# Altium project Monitor_Board_Model_temporary_H202.PrjPcb (part 2 of 3)

## Sheet Membrane_Keypad.SchDoc: Membrane Keypad Interface
size A4; DocumentNumber: 13; SheetNumber: 13; SheetTotal: 31
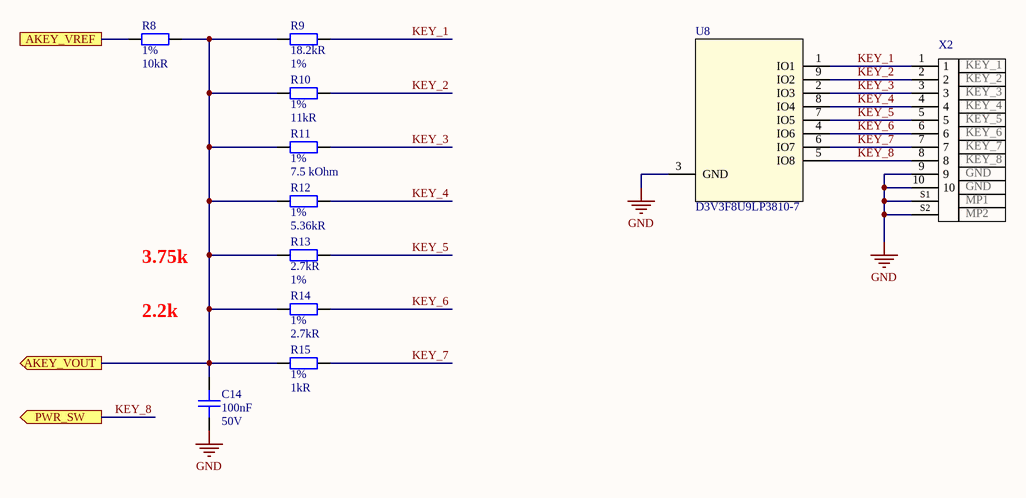
[diagram p5: Membrane_Keypad.SchDoc]

### Parts
C14  Capacitance: 100nF  Voltage: 50V  [C0402]  (hidden comment: CAP CER 0.1UF 50V X7R 0402)
R8  Tolerance: 1%  Resistance: 10kR  [0402R]  (hidden comment: RES SMD 10K OHM 1% 1/16W 0402)
R9  Resistance: 18.2kR  Tolerance: 1%  [R_0402]  (hidden comment: RES SMD 18.2K OHM 1% 1/16W 0402)
R10  Tolerance: 1%  Resistance: 11kR  [R_0402]  (hidden comment: RES SMD 11K OHM 1% 1/16W 0402)
R11  Tolerance: 1%  Resistance: 7.5 kOhm  [R_0402]  (hidden comment: RES SMD 7.5K OHM 1% 1/10W 0603)
R12  Tolerance: 1%  Resistance: 5.36kR  [R_0402]  (hidden comment: RES SMD 5.36K OHM 1% 1/16W 0402)
R13  Resistance: 2.7kR  Tolerance: 1%  [R_0402]  (hidden comment: RC0402FR-072K7L)
R14  Tolerance: 1%  Resistance: 2.7kR  [R_0402]  (hidden comment: RES SMD 2.7K OHM 1% 1/16W 0402)
R15  Tolerance: 1%  Resistance: 1kR  [R_0402]  (hidden comment: RES SMD 1K OHM 1% 1/16W 0402)
U8  D3V3F8U9LP3810-7  [U-DFN3810-9]
X2  pin_7: KEY_7  pin_1: KEY_1  pin_2: KEY_2  pin_3: KEY_3  pin_4: KEY_4  pin_5: KEY_5  pin_6: KEY_6  pin_8: KEY_8  pin_MP2: MP2  pin_MP1: MP1  pin_9: GND  [MOLEX_5034801000]  (hidden comment: CONN 5034801000 FFC FPC 10POS 0.50MM R/A)

### Ports
AKEY_VOUT (out), AKEY_VREF, PWR_SW (out)

### Nets
GND: C14.1 U8.3(GND) X2.9 X2.10 X2.S1(MP1) X2.S2(MP2)
1V8_VDD: R8.2 ; port AKEY_VREF
ADCIN: C14.2 R8.1 R9.1 R10.1 R11.1 R12.1 R13.1 R14.1 R15.1 ; port AKEY_VOUT
KEY_1: R9.2 U8.1(IO1) X2.1
KEY_2: R10.2 U8.9(IO2) X2.2
KEY_3: R11.2 U8.2(IO3) X2.3
KEY_4: R12.2 U8.8(IO4) X2.4
KEY_5: R13.2 U8.7(IO5) X2.5
KEY_6: R14.2 U8.4(IO6) X2.6
KEY_7: R15.2 U8.6(IO7) X2.7
KEY_8: U8.5(IO8) X2.8 ; port PWR_SW  [project net ~{MR}]

### Notes on the sheet
- 3.75k
- 2.2k
- Title
- Size:
- Date:
- A4
- Number:
- Time:
- Revision:
- Sheet
- of
- File:

### Library data of the parts
C14 = CAP CER 0.1UF 50V X7R 0402: 0.1µF ±10% 50V Ceramic Capacitor X7R 0402 (1005 Metric); Manufacturer: TDK; Manufacturer Part Number: CGA2B3X7R1H104K050BB; Supplier 1: Digi-Key; Stock 1: 2925303; Pricing 1: 1=0.17, 10=0.118, 50=0.0668, 100=0.0553, 500=0.0388, 1000=0.0321, 2500=0.0299, 5000=0.0273 (USD); Mount: Surface Mount; Case/Package: 0402; Weight: 2.3E-05oz; Case Code (Metric): 1005; Case Code (Imperial): 0402; Min Operating Temperature: -55°C; Max Operating Temperature: 125°C; Voltage Rating: 50V; Tolerance: 10%; Packaging: Tape and Reel; Package Quantity: 1; Voltage Rating (DC): 50V; Dielectric: X7R; Termination: SMD/SMT; Composition: Ceramic; Length: 1mm; Height: 0.5mm; Width: 0.02inch; Thickness: 0.022inch; Depth: 0.5mm; Ratings: AEC-Q200; REACH SVHC: No SVHC; Lead Free: Lead Free; ComponentLink1URL: http://product.tdk.com/capacitor/mlcc/en/documents/mlccspec_automotive_general_midvoltage_en.pdf?src-supplier=Future+Electronics; ComponentLink1Description: http://product.tdk.com/capacitor/mlcc/en/documents/mlccspec_automotive_general_midvoltage_en.pdf?src-supplier=Future+Electronics; ComponentLink2URL: http://www.farnell.com/datasheets/1807242.pdf?src-supplier=Element14; ComponentLink2Description: http://www.farnell.com/datasheets/1807242.pdf?src-supplier=Element14; ComponentLink3URL: http://www.mouser.com/ds/2/400/lcc_automotive_general_en-843974.pdf?src-supplier=Mouser; ComponentLink3Description: http://www.mouser.com/ds/2/400/lcc_automotive_general_en-843974.pdf?src-supplier=Mouser; ComponentLink4URL: http://www.farnell.com/datasheets/1936565.pdf?src-supplier=Element14; ComponentLink4Description: http://www.farnell.com/datasheets/1936565.pdf?src-supplier=Element14; ComponentLink5URL: http://www.farnell.com/datasheets/1735392.pdf?src-supplier=Element14; ComponentLink5Description: http://www.farnell.com/datasheets/1735392.pdf?src-supplier=Element14; Supplier Part Number 1: 445-6899-1-ND
R8 = RES SMD 10K OHM 1% 1/16W 0402: 10 kOhms ±1% 0.063W, 1/16W Chip Resistor 0402 (1005 Metric) Moisture Resistant Thick Film; Manufacturer: Yageo; Manufacturer Part Number: RC0402FR-0710KP; Temperature Coefficient: 150ppm/°C; Max Power Dissipation: 63mW; Supplier 1: Digi-Key; Stock 1: 839368; Pricing 1: 1=0.1, 10=0.035, 100=0.014, 1000=0.0063, 2500=0.0055, 5000=0.0045 (USD); Case Code (Metric): 1005; Case Code (Imperial): 0402; Min Operating Temperature: -55°C; Max Operating Temperature: 155°C; Packaging: Tape and Reel; Composition: Thick Film; Number of Terminations: 2; Features: Moisture Resistant; Length: 0.039inch; Height: 0.016inch; Width: 0.02inch; ComponentLink1URL: http://www.yageo.com/NewPortal/yageodocoutput?fileName=/pdf/R-Chip/PYu-RC_51_RoHS_P_0.pdf&src-supplier=Digi-Key; ComponentLink1Description: http://www.yageo.com/NewPortal/yageodocoutput?fileName=/pdf/R-Chip/PYu-RC_51_RoHS_P_0.pdf&src-supplier=Digi-Key; Supplier Part Number 1: YAG1249CT-ND; Case/Package: 0402
R9 = RES SMD 18.2K OHM 1% 1/16W 0402: 18.2 kOhms ±1% 0.063W, 1/16W Chip Resistor 0402 (1005 Metric) Moisture Resistant Thick Film; Manufacturer: Yageo; Manufacturer Part Number: RC0402FR-0718K2L; Power Rating: 62.5mW; Temperature Coefficient: 100ppm/°C; Max Power Dissipation: 63mW; Voltage Rating (DC): 50V; Supplier 1: Digi-Key; Stock 1: 372233; Pricing 1: 1=0.1, 10=0.015, 100=0.0062, 1000=0.0028, 2500=0.0024, 5000=0.002 (USD); Case/Package: 0402; Case Code (Imperial): 0402; Case Code (Metric): 1005; Min Operating Temperature: -55°C; Max Operating Temperature: 155°C; Packaging: Tape and Reel; Composition: Thick Film; Number of Terminations: 2; Military Standard: Not; Features: Moisture Resistant; Length: 1mm; Height: 0.016inch; Width: 0.02inch; Depth: 0.5mm; Lead Free: Lead Free; ComponentLink1URL: http://www.yageo.com/documents/recent/PYu-RC0402_51_RoHS_L_6_r.pdf?src-supplier=Future+Electronics; ComponentLink1Description: http://www.yageo.com/documents/recent/PYu-RC0402_51_RoHS_L_6_r.pdf?src-supplier=Future+Electronics; ComponentLink2URL: http://www.yageo.com.tw/exep/pages/download/literatures/PYu-R_INT-thick_7.pdf?src-supplier=Digi-Key; ComponentLink2Description: http://www.yageo.com.tw/exep/pages/download/literatures/PYu-R_INT-thick_7.pdf?src-supplier=Digi-Key; ComponentLink3URL: http://www.mouser.com/ds/2/447/PYu-RC0402_51_RoHS_L_6_r-8721.pdf?src-supplier=Mouser; ComponentLink3Description: http://www.mouser.com/ds/2/447/PYu-RC0402_51_RoHS_L_6_r-8721.pdf?src-supplier=Mouser; Supplier Part Number 1: YAG2371CT-ND; Contact Plating: Tin,Lead,Matte; Package Quantity: 10000; Voltage Rating: 50V; Termination: SMD/SMT; Working Voltage: 50V; Radiation Hardening: No; ComponentLink4URL: http://www.yageo.com/documents/recent/PYu-RC0402_51_RoHS_L_6.pdf?src-supplier=Avnet+Europe; ComponentLink4Description: http://www.yageo.com/documents/recent/PYu-RC0402_51_RoHS_L_6.pdf?src-supplier=Avnet+Europe
R10 = RES SMD 11K OHM 1% 1/16W 0402: 11 kOhms ±1% 0.063W, 1/16W Chip Resistor 0402 (1005 Metric) Moisture Resistant Thick Film; Manufacturer: Yageo; Manufacturer Part Number: RC0402FR-0711KL; Power Rating: 63mW; Voltage Rating: 50V; Temperature Coefficient: 100ppm/°C; Supplier 1: Digi-Key; Stock 1: 632376; Pricing 1: 1=0.1, 10=0.015, 100=0.0062, 1000=0.0028, 2500=0.0024, 5000=0.002 (USD); Case Code (Imperial): 0402; Case Code (Metric): 1005; Min Operating Temperature: -55°C; Max Operating Temperature: 155°C; Packaging: Tape and Reel; Composition: Thick Film; Number of Terminations: 2; Termination: SMD/SMT; Military Standard: Not; Max Power Dissipation: 63mW; Voltage Rating (DC): 50V; Features: Moisture Resistant; Length: 0.039inch; Height: 0.016inch; Width: 0.02inch; Depth: 0.5mm; Lead Free: Lead Free; ComponentLink1URL: http://www.yageo.com/documents/recent/PYu-RC_Group_51_RoHS_L_10.pdf?src-supplier=Digi-Key; ComponentLink1Description: http://www.yageo.com/documents/recent/PYu-RC_Group_51_RoHS_L_10.pdf?src-supplier=Digi-Key; ComponentLink2URL: http://www.yageo.com/documents/recent/PYu-RC_Group_51_RoHS_L_9.pdf?src-supplier=Digi-Key; ComponentLink2Description: http://www.yageo.com/documents/recent/PYu-RC_Group_51_RoHS_L_9.pdf?src-supplier=Digi-Key; Supplier Part Number 1: 311-11.0KLRCT-ND; Case/Package: 0402; ComponentLink3URL: http://www.mouser.com/ds/2/447/PYu-RC0402_51_RoHS_L_6_r-8721.pdf?src-supplier=Mouser; ComponentLink3Description: http://www.mouser.com/ds/2/447/PYu-RC0402_51_RoHS_L_6_r-8721.pdf?src-supplier=Mouser; ComponentLink4URL: http://www.farnell.com/datasheets/1018594.pdf?src-supplier=Farnell; ComponentLink4Description: http://www.farnell.com/datasheets/1018594.pdf?src-supplier=Farnell; Number of Pins: 2; Package Quantity: 1; REACH SVHC: No SVHC
R11 = RES SMD 7.5K OHM 1% 1/10W 0603: 7.5 kOhms ±1% 0.1W, 1/10W Chip Resistor 0603 (1608 Metric) Moisture Resistant Thick Film; Manufacturer: Yageo; Manufacturer Part Number: RC0603FR-077K5L; Power Rating: 100mW; Voltage Rating: 50V; Temperature Coefficient: 100ppm/°C; Working Voltage: 75V; Supplier 1: Digi-Key; Stock 1: 1778854; Pricing 1: 1=0.1, 10=0.023, 100=0.0094, 1000=0.0042, 2500=0.0037 (USD); Case/Package: 0603; Number of Pins: 2; Case Code (Imperial): 0603; Case Code (Metric): 1608; Min Operating Temperature: -55°C; Max Operating Temperature: 155°C; Packaging: Tape and Reel; Package Quantity: 1; Termination: SMD/SMT; Number of Terminations: 2; Max Power Dissipation: 100mW; Features: Moisture Resistant; Voltage Rating (DC): 50V; Length: 1.6mm; Height: 0.45mm; Width: 0.031inch; Depth: 0.8mm; REACH SVHC: No SVHC; Military Standard: Not; Lead Free: Lead Free; ComponentLink1URL: http://www.yageo.com/documents/recent/PYu-RC_Group_51_RoHS_L_10.pdf?src-supplier=Digi-Key; ComponentLink1Description: http://www.yageo.com/documents/recent/PYu-RC_Group_51_RoHS_L_10.pdf?src-supplier=Digi-Key; ComponentLink2URL: http://www.mouser.com/catalog/specsheets/RC0603.pdf?src-supplier=Mouser; ComponentLink2Description: http://www.mouser.com/catalog/specsheets/RC0603.pdf?src-supplier=Mouser; ComponentLink3URL: http://www.farnell.com/datasheets/443971.pdf?src-supplier=Element14; ComponentLink3Description: http://www.farnell.com/datasheets/443971.pdf?src-supplier=Element14; ComponentLink4URL: https://www.verical.com/server-webapp/html/getDatasheet?partID=326523&src-supplier=Verical; ComponentLink4Description: https://www.verical.com/server-webapp/html/getDatasheet?partID=326523&src-supplier=Verical; Supplier Part Number 1: 311-7.50KHRCT-ND; Composition: Thick Film
R12 = RES SMD 5.36K OHM 1% 1/16W 0402: 5.36 kOhms ±1% 0.063W, 1/16W Chip Resistor 0402 (1005 Metric) Moisture Resistant Thick Film; Manufacturer: Yageo; Manufacturer Part Number: RC0402FR-075K36L; Temperature Coefficient: 100ppm/°C; Max Power Dissipation: 63mW; Power Rating: 62.5mW; Voltage Rating: 50V; Supplier 1: Digi-Key; Stock 1: 170749; Pricing 1: 1=0.1, 10=0.016, 100=0.0064, 1000=0.0029, 2500=0.0025, 5000=0.0021 (USD); Case Code (Metric): 1005; Case Code (Imperial): 0402; Min Operating Temperature: -55°C; Max Operating Temperature: 155°C; Packaging: Tape and Reel; Composition: Thick Film; Number of Terminations: 2; Features: Moisture Resistant; Length: 1mm; Height: 0.016inch; Width: 0.02inch; ComponentLink1URL: https://www.verical.com/server-webapp/html/getDatasheet?partID=314179&src-supplier=Verical; ComponentLink1Description: https://www.verical.com/server-webapp/html/getDatasheet?partID=314179&src-supplier=Verical; Supplier Part Number 1: 311-5.36KLRCT-ND; Case/Package: 0402; Contact Plating: Tin,Lead,Matte; Package Quantity: 1; Termination: SMD/SMT; Military Standard: Not; Voltage Rating (DC): 50V; Depth: 0.5mm; Radiation Hardening: No; Lead Free: Lead Free; ComponentLink2URL: http://www.yageo.com/pdf/PYu-RC0402_51_RoHS_L_4.pdf?src-supplier=Avnet; ComponentLink2Description: http://www.yageo.com/pdf/PYu-RC0402_51_RoHS_L_4.pdf?src-supplier=Avnet; ComponentLink3URL: http://www.yageo.com/documents/recent/PYu-RC_Group_51_RoHS_L_10.pdf?src-supplier=Digi-Key; ComponentLink3Description: http://www.yageo.com/documents/recent/PYu-RC_Group_51_RoHS_L_10.pdf?src-supplier=Digi-Key; ComponentLink4URL: http://www.yageo.com/documents/recent/PYu-RC0402_51_RoHS_L_6_r.pdf?src-supplier=Mouser; ComponentLink4Description: http://www.yageo.com/documents/recent/PYu-RC0402_51_RoHS_L_6_r.pdf?src-supplier=Mouser; ComponentLink5URL: http://www.yageo.com/documents/recent/PYu-RC0402_51_RoHS_L_6.pdf?src-supplier=Avnet+Europe; ComponentLink5Description: http://www.yageo.com/documents/recent/PYu-RC0402_51_RoHS_L_6.pdf?src-supplier=Avnet+Europe
R13 = RES SMD 2.7K OHM 1% 1/16W 0402: 2.7 kOhms ±1% 0.063W, 1/16W Chip Resistor 0402 (1005 Metric) Moisture Resistant Thick Film; Manufacturer: Yageo; Max Power Dissipation: 63mW; Temperature Coefficient: 100ppm/°C; Voltage Rating: 50V; Supplier 1: Digi-Key; Manufacturer Part Number: RC0402FR-072K7L; Stock 1: 261850; Pricing 1: 1=0.1, 10=0.016, 100=0.0064, 1000=0.0029, 2500=0.0025, 5000=0.0021 (USD); Case/Package: 0402; Case Code (Metric): 1005; Case Code (Imperial): 0402; Min Operating Temperature: -55°C; Max Operating Temperature: 155°C; Packaging: Tape and Reel; Composition: Thick Film; Number of Terminations: 2; Features: Moisture Resistant; Length: 1mm; Height: 0.016inch; Width: 0.02inch; ComponentLink1URL: http://www.mouser.com/ds/2/447/PYu-RC0402_51_RoHS_L_6_r-8721.pdf?src-supplier=Mouser; ComponentLink1Description: http://www.mouser.com/ds/2/447/PYu-RC0402_51_RoHS_L_6_r-8721.pdf?src-supplier=Mouser; ComponentLink2URL: http://www.yageo.com/documents/recent/PYu-RC_Group_51_RoHS_L_9.pdf?src-supplier=Digi-Key; ComponentLink2Description: http://www.yageo.com/documents/recent/PYu-RC_Group_51_RoHS_L_9.pdf?src-supplier=Digi-Key; Supplier Part Number 1: 311-2.70KLRCT-ND; Package Quantity: 1; Power Rating: 63mW; Termination: SMD/SMT; Military Standard: Not; Depth: 0.5mm; Lead Free: Lead Free; ComponentLink3URL: http://www.yageo.com/documents/recent/PYu-RC_Group_51_RoHS_L_10.pdf?src-supplier=Digi-Key; ComponentLink3Description: http://www.yageo.com/documents/recent/PYu-RC_Group_51_RoHS_L_10.pdf?src-supplier=Digi-Key; Working Voltage: 50V; REACH SVHC: Unknown; ComponentLink4URL: http://www.farnell.com/datasheets/2167052.pdf?src-supplier=Element14; ComponentLink4Description: http://www.farnell.com/datasheets/2167052.pdf?src-supplier=Element14
R14 = RES SMD 2.7K OHM 1% 1/16W 0402: 2.7 kOhms ±1% 0.063W, 1/16W Chip Resistor 0402 (1005 Metric) Moisture Resistant Thick Film; Manufacturer: Yageo; Manufacturer Part Number: RC0402FR-072K7L; Temperature Coefficient: 100ppm/°C; Max Power Dissipation: 63mW; Voltage Rating: 50V; Supplier 1: Digi-Key; Stock 1: 261850; Pricing 1: 1=0.1, 10=0.016, 100=0.0064, 1000=0.0029, 2500=0.0025, 5000=0.0021 (USD); Case/Package: 0402; Case Code (Metric): 1005; Case Code (Imperial): 0402; Min Operating Temperature: -55°C; Max Operating Temperature: 155°C; Packaging: Tape and Reel; Composition: Thick Film; Number of Terminations: 2; Features: Moisture Resistant; Length: 1mm; Height: 0.016inch; Width: 0.02inch; ComponentLink1URL: http://www.mouser.com/ds/2/447/PYu-RC0402_51_RoHS_L_6_r-8721.pdf?src-supplier=Mouser; ComponentLink1Description: http://www.mouser.com/ds/2/447/PYu-RC0402_51_RoHS_L_6_r-8721.pdf?src-supplier=Mouser; ComponentLink2URL: http://www.yageo.com/documents/recent/PYu-RC_Group_51_RoHS_L_9.pdf?src-supplier=Digi-Key; ComponentLink2Description: http://www.yageo.com/documents/recent/PYu-RC_Group_51_RoHS_L_9.pdf?src-supplier=Digi-Key; Supplier Part Number 1: 311-2.70KLRCT-ND; Power Rating: 63mW; Package Quantity: 1; Termination: SMD/SMT; Military Standard: Not; Working Voltage: 50V; Depth: 0.5mm; REACH SVHC: Unknown; Lead Free: Lead Free; ComponentLink3URL: http://www.yageo.com/documents/recent/PYu-RC_Group_51_RoHS_L_10.pdf?src-supplier=Digi-Key; ComponentLink3Description: http://www.yageo.com/documents/recent/PYu-RC_Group_51_RoHS_L_10.pdf?src-supplier=Digi-Key; ComponentLink4URL: http://www.farnell.com/datasheets/2167052.pdf?src-supplier=Element14; ComponentLink4Description: http://www.farnell.com/datasheets/2167052.pdf?src-supplier=Element14
R15 = RES SMD 1K OHM 1% 1/16W 0402: 1 kOhms ±1% 0.063W, 1/16W Chip Resistor 0402 (1005 Metric) Moisture Resistant Thick Film; Manufacturer: Yageo; Manufacturer Part Number: RC0402FR-071KL; Temperature Coefficient: 100ppm/°C; Power Rating: 62.5mW; Voltage Rating: 50V; Supplier 1: Digi-Key; Stock 1: 9574509; Pricing 1: 1=0.1, 10=0.015, 100=0.0062, 1000=0.0028, 2500=0.0024, 5000=0.002 (USD); Case/Package: 0402; Case Code (Imperial): 0402; Case Code (Metric): 1005; Min Operating Temperature: -55°C; Max Operating Temperature: 155°C; Packaging: Tape and Reel; Composition: Thick Film; Termination: SMD/SMT; Military Standard: Not; Length: 1mm; Height: 0.32mm; Width: 0.5mm; Depth: 0.5mm; REACH SVHC: Unknown; Lead Free: Lead Free; ComponentLink1URL: http://www.mouser.com/ds/2/447/PYu-RC0402_51_RoHS_L_6_r-8721.pdf?src-supplier=Mouser; ComponentLink1Description: http://www.mouser.com/ds/2/447/PYu-RC0402_51_RoHS_L_6_r-8721.pdf?src-supplier=Mouser; ComponentLink2URL: http://documents.rs-components.com/techlib://itc_doclist_GB.htm?stockno=6186122&src-supplier=RSComponents; ComponentLink2Description: http://documents.rs-components.com/techlib://itc_doclist_GB.htm?stockno=6186122&src-supplier=RSComponents; ComponentLink3URL: http://www.farnell.com/datasheets/1018594.pdf?src-supplier=Element14; ComponentLink3Description: http://www.farnell.com/datasheets/1018594.pdf?src-supplier=Element14; ComponentLink4URL: http://www.yageo.com/documents/recent/PYu-RC0402_51_RoHS_L_6_r.pdf?src-supplier=Future+Electronics; ComponentLink4Description: http://www.yageo.com/documents/recent/PYu-RC0402_51_RoHS_L_6_r.pdf?src-supplier=Future+Electronics; ComponentLink5URL: http://www.farnell.com/datasheets/2167052.pdf?src-supplier=Element14; ComponentLink5Description: http://www.farnell.com/datasheets/2167052.pdf?src-supplier=Element14; Supplier Part Number 1: 311-1.00KLRCT-ND; Number of Pins: 2; Voltage Rating (DC): 50V
U8 = TVS DIODE PP U-DFN3810-9: 5V (Typ) Clamp 5A (8/20µs) Ipp Tvs Diode Surface Mount U-DFN3810-9; Manufacturer: Diodes; Supplier 1: Digi-Key; Manufacturer Part Number: D3V3F8U9LP3810-7; Stock 1: 14880; Pricing 1: 1=0.42, 10=0.317, 100=0.1508, 500=0.1336, 1000=0.104 (USD); Supplier Part Number 1: D3V3F8U9LP3810-7DICT-ND
X2 = CONN 5034801000 FFC FPC 10POS 0.50MM R/A: 10 Position FFC, FPC Connector Contacts, Top and Bottom 0.020" (0.50mm) Surface Mount, Right Angle; Manufacturer: Molex; Manufacturer Part Number: 503480-1000; Pitch: 0.5mm; Actuator Material: Nylon,Glass,Polyamide; Wire/Cable Type: Straight; Number of Positions: 10; Current Rating: 500mA; Actuator Color: Black; Voltage Rating (AC): 50V; Gender: Receptacle; Stackable: No; ComponentLink1Description: https://www.verical.com/server-webapp/html/getDatasheet?partID=735332&src-supplier=Verical; ComponentLink1URL: https://www.verical.com/server-webapp/html/getDatasheet?partID=735332&src-supplier=Verical; ComponentLink2Description: http://www.mouser.com/ds/2/276/5034801000_FFC_FPC_CONNECTORS-179433.pdf?src-supplier=Mouser; ComponentLink2URL: http://www.mouser.com/ds/2/276/5034801000_FFC_FPC_CONNECTORS-179433.pdf?src-supplier=Mouser; Packaging: Tape and Reel; Length: 6.7mm; Supplier 1: Digi-Key; Stock 1: 36029; Pricing 1: 1=0.89, 10=0.738, 100=0.6148, 1000=0.4918 (USD); Contact Material: Bronze; Contact Plating: Gold; Housing Material: Polymer; Housing Color: White; Min Operating Temperature: -40°C; Max Operating Temperature: 85°C; Termination: Solder; Mating Cycles: 10; Flammability Rating: UL94 V-0; ComponentLink3URL: http://www.molex.com/webdocs/datasheets/pdf/en-us/5034801000_FFC_FPC_CONNECTORS.pdf?src-supplier=Avnet+Europe; ComponentLink3Description: http://www.molex.com/webdocs/datasheets/pdf/en-us/5034801000_FFC_FPC_CONNECTORS.pdf?src-supplier=Avnet+Europe; Supplier Part Number 1: WM1389CT-ND; ComponentLink4URL: https://www.molex.com/pdm_docs/pk/SPK-503480-001.pdf?src-supplier=Digi-Key; ComponentLink4Description: https://www.molex.com/pdm_docs/pk/SPK-503480-001.pdf?src-supplier=Digi-Key; Material: Bronze; Package Quantity: 1; Number of Rows: 1; Voltage Rating: 50V; Max Voltage Rating (AC): 50V; Number of Contacts: 10; Max Voltage Rating (DC): 50V; Orientation: Right Angle; Number of Circuits: 10; Series: BackFlip, Easy-On 503480; Depth: 3.6mm; Radiation Hardening: No; REACH SVHC: Unknown; Halogen Free: Low Halogen; ELV: Compliant; pin_10: GND

## Sheet Visual_User_Interface.SchDoc: User Interface
size A4; DocumentNumber: 15; SheetNumber: 15; SheetTotal: 31
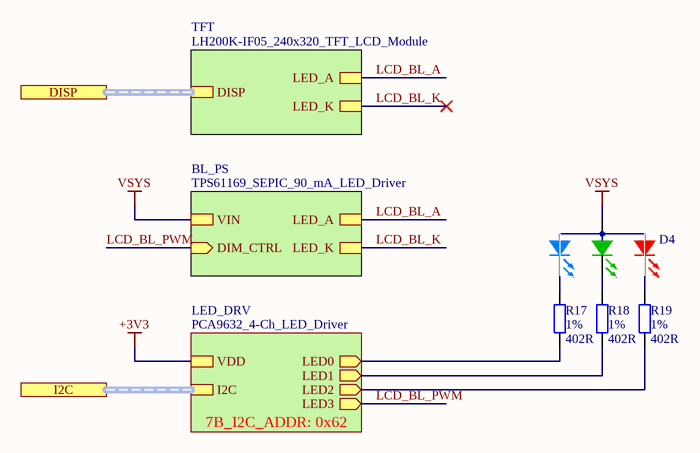
[diagram p6: Visual_User_Interface.SchDoc]

### Parts
D4  150066M153000  [LED_0606_RGB_WURTH]  (value not drawn)
R17  Tolerance: 1%  Resistance: 402R  [R_0402]  (hidden comment: RES SMD 402 OHM 1% 1/16W 0402)
R18  Tolerance: 1%  Resistance: 402R  [R_0402]  (hidden comment: RES SMD 402 OHM 1% 1/16W 0402)
R19  Tolerance: 1%  Resistance: 402R  [R_0402]  (hidden comment: RES SMD 402 OHM 1% 1/16W 0402)

### Sub-sheets
BL_PS = TPS61169_SEPIC_90_mA_LED_Driver (file not in this document): VIN, LED_K, DIM_CTRL (in), LED_A
LED_DRV = PCA9632_4-Ch_LED_Driver (file not in this document): VDD, LED0 (out), LED1 (out), LED2 (out), LED3 (out), I2C (harness I2C)  | 7B_I2C_ADDR: 0x62
TFT = LH200K-IF05_240x320_TFT_LCD_Module (file not in this document): DISP (harness DISP_SPI), LED_K, LED_A

### Ports
DISP (harness DISP_SPI), I2C (harness I2C)

### Nets
VSYS: D4.A ; sheet BL_PS/VIN
LCD_BL_A: sheet BL_PS/LED_A, sheet TFT/LED_A
LCD_BL_K: sheet BL_PS/LED_K, sheet TFT/LED_K
LCD_BL_PWM: sheet LED_DRV/LED3, sheet BL_PS/DIM_CTRL
NetD4_BK: D4.BK R17.2
NetD4_GK: D4.GK R18.2
NetD4_RK: D4.RK R19.2
NetR17_1: R17.1 ; sheet LED_DRV/LED0
NetR18_1: R18.1 ; sheet LED_DRV/LED1
NetR19_1: R19.1 ; sheet LED_DRV/LED2

### Buses and harness runs
harness port DISP = sheet TFT/DISP
harness port I2C = sheet LED_DRV/I2C

### Notes on the sheet
- Title
- Size:
- Date:
- A4
- Number:
- Time:
- Revision:
- Sheet
- of
- File:

### Library data of the parts
D4 = LED RGB DIFFUSED SMD: Red, Green, Blue (RGB) 624nm Red, 525nm Green, 470nm Blue LED Indication - Discrete 2V Red, 3.3V Green, 3.3V Blue 0606 (1616 Metric); Manufacturer: Wurth Electronics; Color: Blue,Green,Red; Lens Style: Flat; Luminous Intensity: 180mcd; Test Current: 20mA; Viewing Angle: 120°; Element Configuration: Common Anode; Lens Size: 1.6mm; Supplier 1: Digi-Key; Manufacturer Part Number: 150066M153000; Stock 1: 7810; Pricing 1: 1=0.51, 50=0.415, 100=0.298, 500=0.272 (USD); Mount: Surface Mount; Case/Package: 0606; Case Code (Imperial): 0606; Case Code (Metric): 1616; Packaging: Tape and Reel; Lens Transparency: Diffused; Forward Voltage: 3.3V; Dominant Wavelength: 470nm; Length: 1.6mm; Height: 0.5mm; Width: 1.6mm; ComponentLink1URL: https://katalog.we-online.de/led/datasheet/150066M153000.pdf?src-supplier=Digi-Key; ComponentLink1Description: https://katalog.we-online.de/led/datasheet/150066M153000.pdf?src-supplier=Digi-Key; ComponentLink2URL: http://www.farnell.com/datasheets/2301702.pdf?src-supplier=Farnell; ComponentLink2Description: http://www.farnell.com/datasheets/2301702.pdf?src-supplier=Farnell; ComponentLink3URL: http://www.farnell.com/datasheets/2301702.pdf?src-supplier=Newark; ComponentLink3Description: http://www.farnell.com/datasheets/2301702.pdf?src-supplier=Newark; ComponentLink4URL: http://www.farnell.com/datasheets/2301702.pdf?src-supplier=Element14; ComponentLink4Description: http://www.farnell.com/datasheets/2301702.pdf?src-supplier=Element14; Supplier Part Number 1: 732-11390-1-ND
R17-R19 = RES SMD 402 OHM 1% 1/16W 0402: 402 Ohms ±1% 0.063W, 1/16W Chip Resistor 0402 (1005 Metric) Moisture Resistant Thick Film; Manufacturer: Yageo; Manufacturer Part Number: RC0402FR-07402RL; Value: 22k; Max Power Dissipation: 63mW; Temperature Coefficient: 100ppm/°C; Power Rating: 62.5mW; Voltage Rating: 50V; Supplier 1: Digi-Key; Stock 1: 0; Pricing 1: 1=0.1, 10=0.016, 100=0.0064, 1000=0.0029, 2500=0.0025, 5000=0.0021 (USD); Case/Package: 0402; Case Code (Metric): 1005; Case Code (Imperial): 0402; Min Operating Temperature: -55°C; Max Operating Temperature: 155°C; Packaging: Tape and Reel; Composition: Thick Film; Number of Terminations: 2; Features: Moisture Resistant; Length: 0.039inch; Height: 0.016inch; Width: 0.02inch; ComponentLink1URL: http://www.yageo.com/documents/recent/PYu-RC0402_51_RoHS_L_6.pdf?src-supplier=Avnet; ComponentLink1Description: http://www.yageo.com/documents/recent/PYu-RC0402_51_RoHS_L_6.pdf?src-supplier=Avnet; ComponentLink2URL: http://www.yageo.com/documents/recent/PYu-RC0402_51_RoHS_L_6.pdf?src-supplier=Avnet+Europe; ComponentLink2Description: http://www.yageo.com/documents/recent/PYu-RC0402_51_RoHS_L_6.pdf?src-supplier=Avnet+Europe; Supplier Part Number 1: YAG3152CT-ND; Contact Plating: Tin,Matte; Termination: SMD/SMT; Military Standard: Not; Depth: 0.5mm; Lead Free: Lead Free; ComponentLink3URL: http://www.mouser.com/ds/2/447/PYu-RC0402_51_RoHS_L_6_r-8721.pdf?src-supplier=Mouser; ComponentLink3Description: http://www.mouser.com/ds/2/447/PYu-RC0402_51_RoHS_L_6_r-8721.pdf?src-supplier=Mouser; Mount: Surface Mount

## Sheet Auxiliary.SchDoc: Auxiliary Components
size A4; DocumentNumber: 17; SheetNumber: 17; SheetTotal: 31
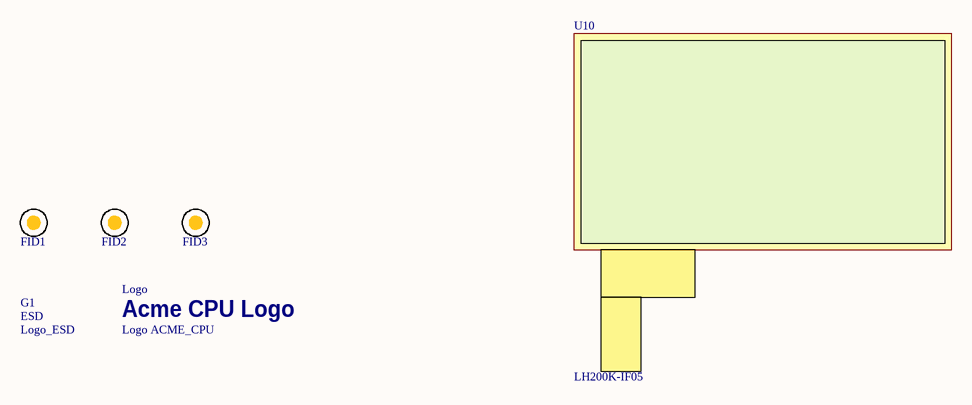
[diagram p7: Auxiliary.SchDoc]

### Parts
FID1  N/A  [Fiducial]  (value not drawn)  (no BOM)
FID2  N/A  [Fiducial]  (value not drawn)  (no BOM)
FID3  N/A  [Fiducial]  (value not drawn)  (no BOM)
G1  Logo_ESD  [Logo_ESD]  (no BOM)
Logo  Logo ACME_CPU  [LOGO_ACME_CPU]  (no BOM)
U10  LH200K-IF05  (mechanical)

### Notes on the sheet
- Title
- Size:
- Date:
- A4
- Number:
- Time:
- Revision:
- Sheet
- of
- File:
- (in symbol Logo ACME_CPU) Acme CPU Logo
- (in symbol Logo_ESD) ESD

### Library data of the parts
FID1-FID3 = Fiducial: Fiducial mark.  There is nothing to buy or mount.; ClassName: FiducialMark; CompType: Fiducial; Manufacturer: N/A; MountType: N/A; PackageReference: Fiducial; Manufacturer Part Number: N/A
U10 = MOD LH200K-IF05 240x320 2-inch TFT LCD Display: 2” TFT LCD Display.; Manufacturer: Shenzhen Limito Technology Inc.; Mount: Not Mounted on PCB; Manufacturer Part Number: LH200K-IF05
Logo = Logo ACME_CPU: ClassName: PCB_FEATURE

## Sheet Audio_Module.SchDoc: Audio Module
size A4; DocumentNumber: 4; SheetNumber: 4; SheetTotal: 31
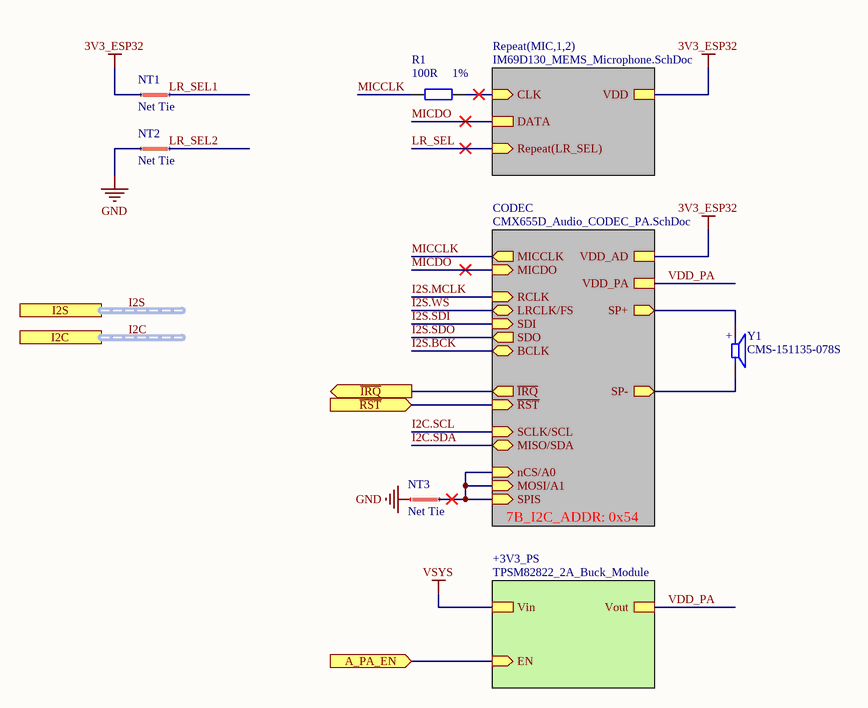
[diagram p8: Audio_Module.SchDoc]

### Parts
NT1  Net Tie  [Net Tie 6x30mil]  (net tie, no BOM)
NT2  Net Tie  [Net Tie 6x30mil]  (net tie, no BOM)
NT3  Net Tie  [Net Tie 6x30mil]  (net tie, no BOM)
R1  Tolerance: 1%  Resistance: 100R  [0402R]  (hidden comment: RES SMD 100 OHM 1% 1/16W 0402)
Y1  CMS-151135-078S  [SPKR_CMS-151135-078S]

### Sub-sheets
+3V3_PS = TPSM82822_2A_Buck_Module (file not in this document): Vout, Vin, EN (in)
CODEC = CMX655D_Audio_CODEC_PA.SchDoc: SP+ (out), SP- (out), VDD_AD, VDD_PA, MICCLK (out), MICDO (in), ~{IRQ} (out), ~{RST} (in), SCLK/SCL (in), MISO/SDA (bidir), MOSI/A1 (in), nCS/A0 (in), SPIS (in), RCLK (in), LRCLK/FS (bidir), SDI (in), SDO (out), BCLK (bidir)  | 7B_I2C_ADDR: 0x54
Repeat(MIC,1,2) = IM69D130_MEMS_Microphone.SchDoc: CLK (in), DATA, VDD, Repeat(LR_SEL) (in)

### Ports
A_PA_EN (in), I2C (harness I2C), I2S (harness I2S), ~{IRQ} (out), ~{RST} (in)

### Nets
3V3_ESP32: NT1.1 ; sheet Repeat(MIC,1,2)/VDD, sheet CODEC/VDD_AD
GND: NT2.1 NT3.1
~{A_IRQ}: port ~{IRQ}, sheet CODEC/~{IRQ}
~{A_RST}: port ~{RST}, sheet CODEC/~{RST}
A_PA_EN: port A_PA_EN, sheet +3V3_PS/EN
LR_SEL: sheet Repeat(MIC,1,2)/Repeat(LR_SEL)
LR_SEL1: NT1.2
LR_SEL2: NT2.2
MICCLK: R1.2 ; sheet CODEC/MICCLK
MICDO: sheet Repeat(MIC,1,2)/DATA, sheet CODEC/MICDO
VDD_PA: sheet CODEC/VDD_PA, sheet +3V3_PS/Vout
NetNT3_2: NT3.2 ; sheet CODEC/MOSI/A1, sheet CODEC/nCS/A0, sheet CODEC/SPIS
NetR1_1: R1.1 ; sheet Repeat(MIC,1,2)/CLK
NetU3_1: Y1.M ; sheet CODEC/SP-
NetU3_23: Y1.P ; sheet CODEC/SP+

### Buses and harness runs
harness I2C = port I2C
harness I2S = port I2S

### Notes on the sheet
- Title
- Size:
- Date:
- A4
- Number:
- Time:
- Revision:
- Sheet
- of
- File:
- (in symbol SPEAKER CMS-151135-078S 15 X 11 MM ENCLOSED) +

### Library data of the parts
NT1-NT3 = Net Tie Line: ClassName: Net Tie
R1 = RES SMD 100 OHM 1% 1/16W 0402: 100 Ohms ±1% 0.063W, 1/16W Chip Resistor 0402 (1005 Metric) Moisture Resistant Thick Film; Manufacturer: Yageo; Manufacturer Part Number: RC0402FR-07100RL; Power Rating: 62.5mW; Voltage Rating: 50V; Temperature Coefficient: 100ppm/°C; Supplier 1: Digi-Key; Stock 1: 16989760; Pricing 1: 1=0.1, 10=0.016, 100=0.0064, 1000=0.0029, 2500=0.0025, 5000=0.0021 (USD); Case/Package: 0402; Number of Pins: 2; Case Code (Imperial): 0402; Case Code (Metric): 1005; Min Operating Temperature: -55°C; Max Operating Temperature: 155°C; Voltage Rating (DC): 50V; Packaging: Tape and Reel; Termination: SMD/SMT; Composition: Thick Film; Military Standard: Not; Length: 1mm; Height: 0.32mm; Width: 0.5mm; Depth: 0.5mm; REACH SVHC: No SVHC; Lead Free: Lead Free; ComponentLink1URL: http://www.farnell.com/datasheets/2167052.pdf?src-supplier=Element14; ComponentLink1Description: http://www.farnell.com/datasheets/2167052.pdf?src-supplier=Element14; ComponentLink2URL: http://www.yageo.com/documents/recent/PYu-RC_Group_51_RoHS_L_9.pdf?src-supplier=Mouser; ComponentLink2Description: http://www.yageo.com/documents/recent/PYu-RC_Group_51_RoHS_L_9.pdf?src-supplier=Mouser; ComponentLink3URL: http://www.yageo.com/documents/recent/PYu-RC0402_51_RoHS_L_6_r.pdf?src-supplier=Future+Electronics; ComponentLink3Description: http://www.yageo.com/documents/recent/PYu-RC0402_51_RoHS_L_6_r.pdf?src-supplier=Future+Electronics; ComponentLink4URL: https://www.verical.com/server-webapp/html/getDatasheet?partID=329466&src-supplier=Verical; ComponentLink4Description: https://www.verical.com/server-webapp/html/getDatasheet?partID=329466&src-supplier=Verical; ComponentLink5URL: http://www.farnell.com/datasheets/1018594.pdf?src-supplier=Element14; ComponentLink5Description: http://www.farnell.com/datasheets/1018594.pdf?src-supplier=Element14; ComponentLink6URL: http://documents.rs-components.com/techlib://itc_doclist_GB.htm?stockno=6185810&src-supplier=RSComponents; ComponentLink6Description: http://documents.rs-components.com/techlib://itc_doclist_GB.htm?stockno=6185810&src-supplier=RSComponents; Supplier Part Number 1: 311-100LRDKR-ND
Y1 = SPEAKER CMS-151135-078S 15 X 11 MM ENCLOSED: 8 Ohms General Purpose Speaker 700mW 100Hz ~ 20kHz Top Rectangular; Manufacturer: CUI; Sensing Method: Magnetic; Self Resonant Frequency: 550Hz; Impedance: 8R; Max Power Dissipation: 1W; Supplier 1: Digi-Key; Manufacturer Part Number: CMS-151135-078S; Stock 1: 1971; Pricing 1: 1=2.07, 10=1.72, 25=1.5888, 50=1.4932, 100=1.4013, 500=1.2016, 1000=1.17 (USD); Packaging: Tray; ComponentLink1URL: https://www.cui.com/product/resource/digikeypdf/CMS-15113-078x.pdf?src-supplier=Digi-Key; ComponentLink1Description: https://www.cui.com/product/resource/digikeypdf/CMS-15113-078x.pdf?src-supplier=Digi-Key; Supplier Part Number 1: 102-4616-ND; Shape: Rectangular; Type: General Purpose; Power Rating: 700mW

## Sheet IM69D130_MEMS_Microphone.SchDoc: IM69D130 PDM MEMS Microphone
size A4; DocumentNumber: 5; SheetNumber: 5; SheetTotal: 31
Used 2 times, as channels AUDIO/MIC1, AUDIO/MIC2. Parts and nets are listed once, with the designators drawn on the sheet.
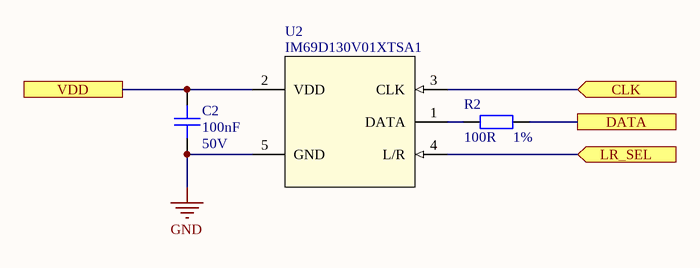
[diagram p9: IM69D130_MEMS_Microphone.SchDoc]

### Parts
C2  Capacitance: 100nF  Voltage: 50V  [C0402]  (hidden comment: CAP CER 0.1UF 50V X7R 0402)
R2  Tolerance: 1%  Resistance: 100R  [0402R]  (hidden comment: RES SMD 100 OHM 1% 1/16W 0402)
U2  IM69D130V01XTSA1  [MIC_IM69D130V01XTSA1]

### Ports
CLK (in), DATA, LR_SEL (in), VDD

### Nets
GND: C2.1 U2.5(GND)
CLK: U2.3(CLK) ; port CLK
DATA: R2.1 ; port DATA
LR_SEL: U2.4(L/R) ; port LR_SEL
VDD: C2.2 U2.2(VDD) ; port VDD
NetR2_2: R2.2 U2.1(DATA)

### Channels
AUDIO/MIC1: designators C2=C1#1 R2=R2 U2=U1#1; ports CLK=NetR1_1 DATA=MICDO LR_SEL=LR_SEL1 VDD=3V3_ESP32
AUDIO/MIC2: designators C2=C2 R2=R3#1 U2=U2; ports CLK=NetR1_1 DATA=MICDO LR_SEL=LR_SEL2 VDD=3V3_ESP32

### Notes on the sheet
- Title
- Size:
- Date:
- A4
- Number:
- Time:
- Revision:
- Sheet
- of
- File:

### Library data of the parts
C2 = CAP CER 0.1UF 50V X7R 0402: as C14 on sheet Membrane_Keypad; Supplier 1: Digi-Key; Stock 1: 2925303; Pricing 1: 1=0.17, 10=0.118, 50=0.0668, 100=0.0553, 500=0.0388, 1000=0.0321, 2500=0.0299, 5000=0.0273 (USD); Mount: Surface Mount; Case/Package: 0402; Weight: 2.3E-05oz; Case Code (Metric): 1005; Case Code (Imperial): 0402; Min Operating Temperature: -55°C; Max Operating Temperature: 125°C; Voltage Rating: 50V; Tolerance: 10%; Packaging: Tape and Reel; Package Quantity: 1; Voltage Rating (DC): 50V; Dielectric: X7R; Termination: SMD/SMT; Composition: Ceramic; Length: 1mm; Height: 0.5mm; Width: 0.02inch; Thickness: 0.022inch; Depth: 0.5mm; Ratings: AEC-Q200; REACH SVHC: No SVHC; Lead Free: Lead Free; ComponentLink1URL: http://product.tdk.com/capacitor/mlcc/en/documents/mlccspec_automotive_general_midvoltage_en.pdf?src-supplier=Future+Electronics; ComponentLink1Description: http://product.tdk.com/capacitor/mlcc/en/documents/mlccspec_automotive_general_midvoltage_en.pdf?src-supplier=Future+Electronics; ComponentLink2URL: http://www.farnell.com/datasheets/1807242.pdf?src-supplier=Element14; ComponentLink2Description: http://www.farnell.com/datasheets/1807242.pdf?src-supplier=Element14; ComponentLink3URL: http://www.mouser.com/ds/2/400/lcc_automotive_general_en-843974.pdf?src-supplier=Mouser; ComponentLink3Description: http://www.mouser.com/ds/2/400/lcc_automotive_general_en-843974.pdf?src-supplier=Mouser; ComponentLink4URL: http://www.farnell.com/datasheets/1936565.pdf?src-supplier=Element14; ComponentLink4Description: http://www.farnell.com/datasheets/1936565.pdf?src-supplier=Element14; ComponentLink5URL: http://www.farnell.com/datasheets/1735392.pdf?src-supplier=Element14; ComponentLink5Description: http://www.farnell.com/datasheets/1735392.pdf?src-supplier=Element14; Supplier Part Number 1: 445-6899-1-ND
R2 = RES SMD 100 OHM 1% 1/16W 0402: as R1 on sheet Audio_Module; Supplier 1: Digi-Key; Stock 1: 16989760; Pricing 1: 1=0.1, 10=0.016, 100=0.0064, 1000=0.0029, 2500=0.0025, 5000=0.0021 (USD); Case/Package: 0402; Number of Pins: 2; Case Code (Imperial): 0402; Case Code (Metric): 1005; Min Operating Temperature: -55°C; Max Operating Temperature: 155°C; Voltage Rating (DC): 50V; Packaging: Tape and Reel; Termination: SMD/SMT; Composition: Thick Film; Military Standard: Not; Length: 1mm; Height: 0.32mm; Width: 0.5mm; Depth: 0.5mm; REACH SVHC: No SVHC; Lead Free: Lead Free; ComponentLink1URL: http://www.farnell.com/datasheets/2167052.pdf?src-supplier=Element14; ComponentLink1Description: http://www.farnell.com/datasheets/2167052.pdf?src-supplier=Element14; ComponentLink2URL: http://www.yageo.com/documents/recent/PYu-RC_Group_51_RoHS_L_9.pdf?src-supplier=Mouser; ComponentLink2Description: http://www.yageo.com/documents/recent/PYu-RC_Group_51_RoHS_L_9.pdf?src-supplier=Mouser; ComponentLink3URL: http://www.yageo.com/documents/recent/PYu-RC0402_51_RoHS_L_6_r.pdf?src-supplier=Future+Electronics; ComponentLink3Description: http://www.yageo.com/documents/recent/PYu-RC0402_51_RoHS_L_6_r.pdf?src-supplier=Future+Electronics; ComponentLink4URL: https://www.verical.com/server-webapp/html/getDatasheet?partID=329466&src-supplier=Verical; ComponentLink4Description: https://www.verical.com/server-webapp/html/getDatasheet?partID=329466&src-supplier=Verical; ComponentLink5URL: http://www.farnell.com/datasheets/1018594.pdf?src-supplier=Element14; ComponentLink5Description: http://www.farnell.com/datasheets/1018594.pdf?src-supplier=Element14; ComponentLink6URL: http://documents.rs-components.com/techlib://itc_doclist_GB.htm?stockno=6185810&src-supplier=RSComponents; ComponentLink6Description: http://documents.rs-components.com/techlib://itc_doclist_GB.htm?stockno=6185810&src-supplier=RSComponents; Supplier Part Number 1: 311-100LRDKR-ND
U2 = IC IM69D130 MICROPHONE MEMS DIGITAL PDM OMNI: 20Hz ~ 20kHz Digital, PDM Microphone MEMS (Silicon) 1.62V ~ 3.6V Omnidirectional (-36dB ±1dB @ 94dB SPL) Solder Pads; Manufacturer: Infineon; Shape: Rectangular; Max Frequency: 3.3MHz; Operating Supply Voltage: -3.6V; Operating Supply Current: 1.3mA; Supplier 1: Digi-Key; Manufacturer Part Number: IM69D130V01XTSA1; Stock 1: 16861; Pricing 1: 1=1.76, 10=1.458, 25=1.3476, 50=1.2674, 100=1.19, 500=1.0214 (USD); Output Type: Digital; Direction: Omnidirectional; Packaging: Cut Tape; Termination: Solder; Lead Free: Lead Free; Halogen Free: Halogen Free; RoHS Compliant: Yes; ComponentLink1URL: http://www.farnell.com/datasheets/2718732.pdf?src-supplier=Newark; ComponentLink1Description: http://www.farnell.com/datasheets/2718732.pdf?src-supplier=Newark; ComponentLink2URL: https://www.infineon.com/dgdl/Infineon-IM69D130-DS-v01_00-EN.pdf?fileId=5546d462602a9dc801607a0e46511a2e&src-supplier=Digi-Key; ComponentLink2Description: https://www.infineon.com/dgdl/Infineon-IM69D130-DS-v01_00-EN.pdf?fileId=5546d462602a9dc801607a0e46511a2e&src-supplier=Digi-Key; ComponentLink3URL: http://www.farnell.com/datasheets/2718732.pdf?src-supplier=Farnell; ComponentLink3Description: http://www.farnell.com/datasheets/2718732.pdf?src-supplier=Farnell; Supplier Part Number 1: IM69D130V01XTSA1CT-ND

## Sheet CMX655D_Audio_CODEC_PA.SchDoc: CMX655D Audio CODEC with PA
size A4; DocumentNumber: 6; SheetNumber: 6; SheetTotal: 31
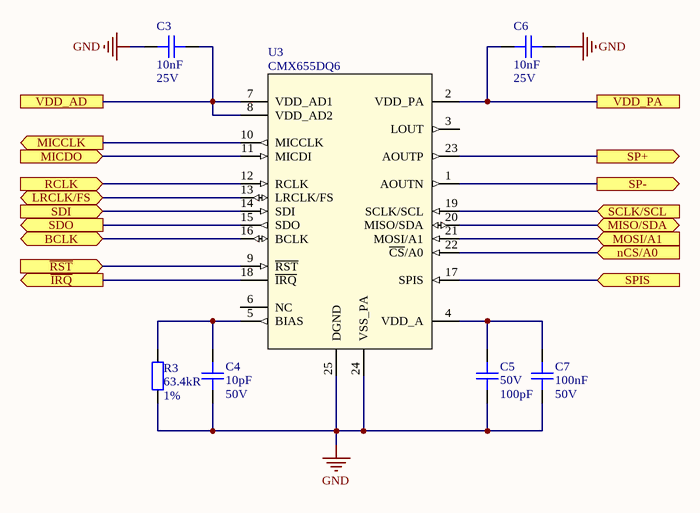
[diagram p10: CMX655D_Audio_CODEC_PA.SchDoc]

### Parts
(Parts that share a designator on the sheet are numbered #1, #2 ... from top to bottom, then left to right.)
C3  Capacitance: 10nF  Voltage: 25V  [C0402]  (hidden comment: CAP CER 10nF 25V X7R 10% 0402)
C4  Capacitance: 10pF  Voltage Rating: 50V  [C0402]  (hidden comment: CAP CER 10PF 50V C0G/NP0 0402)
C5  Voltage: 50V  Capacitance: 100pF  [CAP_0402]  (hidden comment: C 100pF 50V C0G, NP0 0402)
C6  Capacitance: 10nF  Voltage: 25V  [C0402]  (hidden comment: CAP CER 10nF 25V X7R 10% 0402)
C7  Capacitance: 100nF  Voltage: 50V  [C0402]  (hidden comment: CAP CER 0.1UF 50V X7R 0402)
R3#2  Resistance: 63.4kR  Tolerance: 1%  [R_0402]  (hidden comment: RES SMD 63.4K OHM 1% 1/16W 0402)
U3  CMX655DQ6  [QFN50P400X400X100_HS-25N]

### Ports
BCLK (bidir), LRCLK/FS (bidir), MICCLK (out), MICDO (in), MISO/SDA (bidir), MOSI/A1 (in), nCS/A0 (in), RCLK (in), SCLK/SCL (in), SDI (in), SDO (out), SP+ (out), SP- (out), SPIS (in), VDD_AD, VDD_PA, ~{IRQ} (out), ~{RST} (in)

### Nets
3V3_ESP32: C3.2 U3.7(VDD_AD1) U3.8(VDD_AD2) ; port VDD_AD
GND: C3.1 C4.1 C5.1 C6.1 C7.1 R3#2.2 U3.24(VSS_PA) U3.25(DGND)
~{A_IRQ}: U3.18(~{IRQ}) ; port ~{IRQ}
~{A_RST}: U3.9(~{RST}) ; port ~{RST}
I2C.SCL: U3.19(SCLK/SCL) ; port SCLK/SCL
I2C.SDA: U3.20(MISO/SDA) ; port MISO/SDA
I2S.BCK: U3.16(BCLK) ; port BCLK
I2S.MCLK: U3.12(RCLK) ; port RCLK
I2S.SDI: U3.14(SDI) ; port SDI
I2S.SDO: U3.15(SDO) ; port SDO
I2S.WS: U3.13(LRCLK/FS) ; port LRCLK/FS
MICCLK: U3.10(MICCLK) ; port MICCLK
MICDO: U3.11(MICDI) ; port MICDO
VDD_PA: C6.2 U3.2(VDD_PA) ; port VDD_PA
NetC4_2: C4.2 R3#2.1 U3.5(BIAS)
NetC5_2: C5.2 C7.2 U3.4(VDD_A)
NetNT3_2: U3.17(SPIS) U3.21(MOSI/A1) U3.22(~{CS}/A0) ; port MOSI/A1, port nCS/A0, port SPIS
NetU3_1: U3.1(AOUTN) ; port SP-
NetU3_23: U3.23(AOUTP) ; port SP+

Not connected (* = marked no-connect by the designer): U3 3(LOUT) 6(NC)

### Notes on the sheet
- Title
- Size:
- Date:
- A4
- Number:
- Time:
- Revision:
- Sheet
- of
- File:

### Library data of the parts
C3 C6 = CAP CER 10nF 25V X7R 10% 0402: Manufacturer: Kyocera AVX; Manufacturer Part Number: 04023C103KAT2A; Dissipation Factor: 12.5%; Insulation Resistance: 100GR; Supplier 1: Digi-Key; Stock 1: 1015537; Pricing 1: 1=0.1, 10=0.034, 50=0.0182, 100=0.0149, 500=0.0107, 1000=0.0084, 2500=0.0076, 5000=0.007 (USD); Mount: Surface Mount,PCB; Case/Package: 0402; Case Code (Metric): 1005; Case Code (Imperial): 0402; Min Operating Temperature: -55°C; Max Operating Temperature: 125°C; Tolerance: 10%; Dielectric: X7R; Voltage Rating (DC): 25V; Packaging: Tape and Reel; Voltage Rating: 25V; Package Quantity: 1; Termination: SMD/SMT; Length: 1mm; Height: 0.56mm; Depth: 0.5mm; Width: 0.02inch; Thickness: 0.022inch; Radiation Hardening: No; REACH SVHC: No SVHC; Lead Free: Lead Free; ComponentLink1URL: http://www.farnell.com/datasheets/2237835.pdf?src-supplier=Element14; ComponentLink1Description: http://www.farnell.com/datasheets/2237835.pdf?src-supplier=Element14; ComponentLink2URL: http://catalogs.avx.com/SurfaceMount.pdf?src-supplier=Digi-Key; ComponentLink2Description: http://catalogs.avx.com/SurfaceMount.pdf?src-supplier=Digi-Key; ComponentLink3URL: http://www.alliedelec.com/m/d/a24bb5190bea413b2ff164816f55e87c.pdf?src-supplier=Allied+Electronics; ComponentLink3Description: http://www.alliedelec.com/m/d/a24bb5190bea413b2ff164816f55e87c.pdf?src-supplier=Allied+Electronics; ComponentLink4URL: http://uk.rs-online.com/webdocs/13ec/0900766b813ece35.pdf?src-supplier=RSComponents; ComponentLink4Description: http://uk.rs-online.com/webdocs/13ec/0900766b813ece35.pdf?src-supplier=RSComponents; Supplier Part Number 1: 478-1113-1-ND
C4 = CAP CER 10PF 50V C0G/NP0 0402: 10pF ±10% 50V Ceramic Capacitor C0G, NP0 0402 (1005 Metric); Manufacturer: KEMET; Manufacturer Part Number: C0402C100K5GACTU; Dissipation Factor: 0.1%; Supplier 1: Digi-Key; Stock 1: 57093; Pricing 1: 1=0.1, 10=0.021, 50=0.0116, 100=0.0095, 500=0.0068, 1000=0.0053, 2500=0.0048, 5000=0.0045 (USD); Mount: Surface Mount; Case/Package: 0402; Case Code (Metric): 1005; Case Code (Imperial): 0402; Dielectric Material: Ceramic; Min Operating Temperature: -55°C; Max Operating Temperature: 125°C; Tolerance: 10%; Packaging: Tape and Reel; Package Quantity: 10000; Voltage Rating (DC): 50V; Dielectric: C0G; Termination: SMD/SMT; Length: 1mm; Height: 0.5mm; Width: 0.02inch; Thickness: 0.022inch; Lead Pitch: 0.3mm; Depth: 0.5mm; Radiation Hardening: No; REACH SVHC: No SVHC; Lead Free: Lead Free; ComponentLink1URL: http://www.mouser.com/ds/2/212/KEM_C1003_C0G_SMD-1101588.pdf?src-supplier=Mouser; ComponentLink1Description: http://www.mouser.com/ds/2/212/KEM_C1003_C0G_SMD-1101588.pdf?src-supplier=Mouser; Supplier Part Number 1: 399-7747-1-ND
C5 = C 100pF 50V C0G, NP0 0402: 100pF ±5% 50V Ceramic Capacitor C0G, NP0 0402 (1005 Metric); Manufacturer: Yageo; Manufacturer Part Number: CC0402JRNPO9BN101; Temperature Coefficient: 30ppm/°C; Insulation Resistance: 100GR; Supplier 1: Digi-Key; Stock 1: 4235236; Pricing 1: 1=0.1, 10=0.02, 100=0.0089, 500=0.0064, 1000=0.005, 2500=0.0046, 5000=0.0042 (USD); Mount: Surface Mount; Case/Package: 0402; Number of Pins: 2; Case Code (Imperial): 0402; Case Code (Metric): 1005; Dielectric Material: Ceramic; Min Operating Temperature: -55°C; Max Operating Temperature: 125°C; Tolerance: 5%; Voltage Rating (DC): 50V; Packaging: Tape and Reel; Package Quantity: 1; Termination: SMD/SMT; Composition: Ceramic; Length: 1mm; Height: 0.5mm; Width: 0.5mm; Thickness: 0.022inch; Depth: 0.5mm; Radiation Hardening: No; REACH SVHC: No SVHC; Lead Free: Lead Free; ComponentLink1URL: http://www.farnell.com/datasheets/2213336.pdf?src-supplier=Newark; ComponentLink1Description: http://www.farnell.com/datasheets/2213336.pdf?src-supplier=Newark; ComponentLink2URL: http://www.yageo.com/documents/recent/UPY-GP_NP0_16V-to-50V_16.pdf?src-supplier=Digi-Key; ComponentLink2Description: http://www.yageo.com/documents/recent/UPY-GP_NP0_16V-to-50V_16.pdf?src-supplier=Digi-Key; ComponentLink3URL: http://documents.rs-components.com/techlib://itc_doclist_GB.htm?stockno=6698684&src-supplier=RSComponents; ComponentLink3Description: http://documents.rs-components.com/techlib://itc_doclist_GB.htm?stockno=6698684&src-supplier=RSComponents; ComponentLink4URL: http://www.yageo.com/documents/recent/UPY-GP_NP0_16V-to-50V_8.pdf?src-supplier=Avnet+Europe; ComponentLink4Description: http://www.yageo.com/documents/recent/UPY-GP_NP0_16V-to-50V_8.pdf?src-supplier=Avnet+Europe; ComponentLink5URL: http://www.farnell.com/datasheets/1443161.pdf?src-supplier=Element14; ComponentLink5Description: http://www.farnell.com/datasheets/1443161.pdf?src-supplier=Element14; ComponentLink6URL: http://www.farnell.com/datasheets/2213336.pdf?src-supplier=Element14; ComponentLink6Description: http://www.farnell.com/datasheets/2213336.pdf?src-supplier=Element14; Supplier Part Number 1: 311-1024-1-ND; Dielectric: C0G; Voltage Rating: 50V
C7 = CAP CER 0.1UF 50V X7R 0402: as C14 on sheet Membrane_Keypad; Supplier 1: Digi-Key; Stock 1: 2925303; Pricing 1: 1=0.17, 10=0.118, 50=0.0668, 100=0.0553, 500=0.0388, 1000=0.0321, 2500=0.0299, 5000=0.0273 (USD); Mount: Surface Mount; Case/Package: 0402; Weight: 2.3E-05oz; Case Code (Metric): 1005; Case Code (Imperial): 0402; Min Operating Temperature: -55°C; Max Operating Temperature: 125°C; Voltage Rating: 50V; Tolerance: 10%; Packaging: Tape and Reel; Package Quantity: 1; Voltage Rating (DC): 50V; Dielectric: X7R; Termination: SMD/SMT; Composition: Ceramic; Length: 1mm; Height: 0.5mm; Width: 0.02inch; Thickness: 0.022inch; Depth: 0.5mm; Ratings: AEC-Q200; REACH SVHC: No SVHC; Lead Free: Lead Free; ComponentLink1URL: http://product.tdk.com/capacitor/mlcc/en/documents/mlccspec_automotive_general_midvoltage_en.pdf?src-supplier=Future+Electronics; ComponentLink1Description: http://product.tdk.com/capacitor/mlcc/en/documents/mlccspec_automotive_general_midvoltage_en.pdf?src-supplier=Future+Electronics; ComponentLink2URL: http://www.farnell.com/datasheets/1807242.pdf?src-supplier=Element14; ComponentLink2Description: http://www.farnell.com/datasheets/1807242.pdf?src-supplier=Element14; ComponentLink3URL: http://www.mouser.com/ds/2/400/lcc_automotive_general_en-843974.pdf?src-supplier=Mouser; ComponentLink3Description: http://www.mouser.com/ds/2/400/lcc_automotive_general_en-843974.pdf?src-supplier=Mouser; ComponentLink4URL: http://www.farnell.com/datasheets/1936565.pdf?src-supplier=Element14; ComponentLink4Description: http://www.farnell.com/datasheets/1936565.pdf?src-supplier=Element14; ComponentLink5URL: http://www.farnell.com/datasheets/1735392.pdf?src-supplier=Element14; ComponentLink5Description: http://www.farnell.com/datasheets/1735392.pdf?src-supplier=Element14; Supplier Part Number 1: 445-6899-1-ND
R3#2 = RES SMD 63.4K OHM 1% 1/16W 0402: 63.4 kOhms ±1% 0.063W, 1/16W Chip Resistor 0402 (1005 Metric) Moisture Resistant Thick Film; Manufacturer: Yageo; Manufacturer Part Number: RC0402FR-0763K4L; Power Rating: 62.5mW; Voltage Rating: 50V; Temperature Coefficient: 100ppm/°C; Max Power Dissipation: 63mW; Supplier 1: Digi-Key; Stock 1: 453897; Pricing 1: 1=0.1, 10=0.015, 100=0.0062, 1000=0.0028, 2500=0.0024, 5000=0.002 (USD); Case/Package: 0402; Case Code (Imperial): 0402; Case Code (Metric): 1005; Contact Plating: Tin,Matte; Min Operating Temperature: -55°C; Max Operating Temperature: 155°C; Packaging: Tape and Reel; Composition: Thick Film; Number of Terminations: 2; Termination: SMD/SMT; Military Standard: Not; Features: Moisture Resistant; Length: 1mm; Height: 0.016inch; Width: 0.02inch; Depth: 0.5mm; Lead Free: Lead Free; ComponentLink1URL: http://www.yageo.com/documents/recent/PYu-RC0402_51_RoHS_L_6.pdf?src-supplier=Avnet+Europe; ComponentLink1Description: http://www.yageo.com/documents/recent/PYu-RC0402_51_RoHS_L_6.pdf?src-supplier=Avnet+Europe; ComponentLink2URL: http://www.yageo.com/documents/recent/PYu-RC0402_51_RoHS_L_6_r.pdf?src-supplier=Future+Electronics; ComponentLink2Description: http://www.yageo.com/documents/recent/PYu-RC0402_51_RoHS_L_6_r.pdf?src-supplier=Future+Electronics; ComponentLink3URL: http://www.yageo.com/documents/recent/PYu-RC0402_51_RoHS_L_6.pdf?src-supplier=Avnet; ComponentLink3Description: http://www.yageo.com/documents/recent/PYu-RC0402_51_RoHS_L_6.pdf?src-supplier=Avnet; Supplier Part Number 1: YAG3204CT-ND
U3 = IC CMX655DQ6-TR1K VOICE CODEC 16BIT 24VQFN: Voice-Band Interface 16 b I²S, PCM, SPI 24-VQFN (4x4); Manufacturer: CML Microcircuits; Supplier 1: Mouser; Manufacturer Part Number: CMX655DQ6; Stock 1: 164; Pricing 1: 1=1.41, 10=1.41, 50=1.36, 100=1.22, 1000=1.07, 10000=1.01 (USD); Mount: Surface Mount; Case/Package: VQFN; Packaging: Cut Tape; ComponentLink1URL: https://www.cmlmicro.com/wp-content/uploads/2018/10/CMX655_ds.pdf?src-supplier=Digi-Key; ComponentLink1Description: https://www.cmlmicro.com/wp-content/uploads/2018/10/CMX655_ds.pdf?src-supplier=Digi-Key; Supplier Part Number 1: 226-CMX655DQ6; Supplier 2: Digi-Key; Supplier Part Number 2: 2032-1036-1-ND